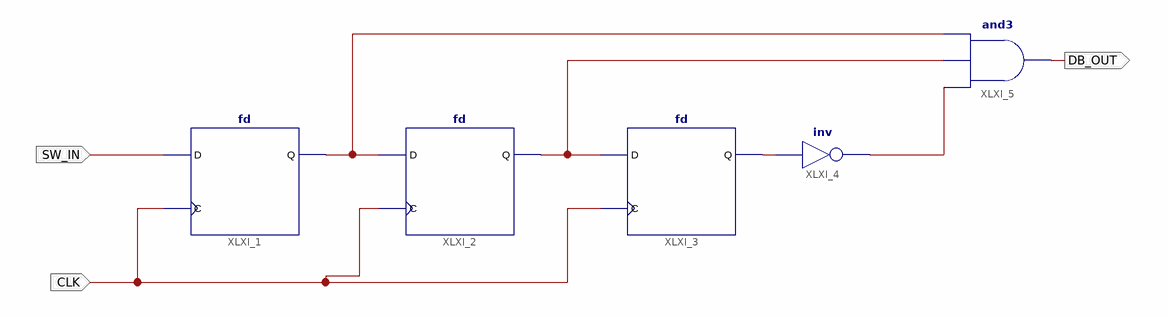
[diagram p0: schematic sheet 1]
// Xilinx ISE schematic debounceSW.sch (spartan6) as structural Verilog: 5 symbols, 3 ports
module debounceSW (
  input  SW_IN,
  input  CLK,
  output DB_OUT
);

  wire XLXN_3, XLXN_6, XLXN_7, XLXN_8;

  fd XLXI_1 (.C(CLK), .D(SW_IN), .Q(XLXN_8));
  fd XLXI_2 (.C(CLK), .D(XLXN_8), .Q(XLXN_7));
  fd XLXI_3 (.C(CLK), .D(XLXN_7), .Q(XLXN_3));
  not XLXI_4 (XLXN_6, XLXN_3);
  and XLXI_5 (DB_OUT, XLXN_6, XLXN_7, XLXN_8);
endmodule
